# EAGLE design dc-dc-converter (EAGLE 9.0.0)
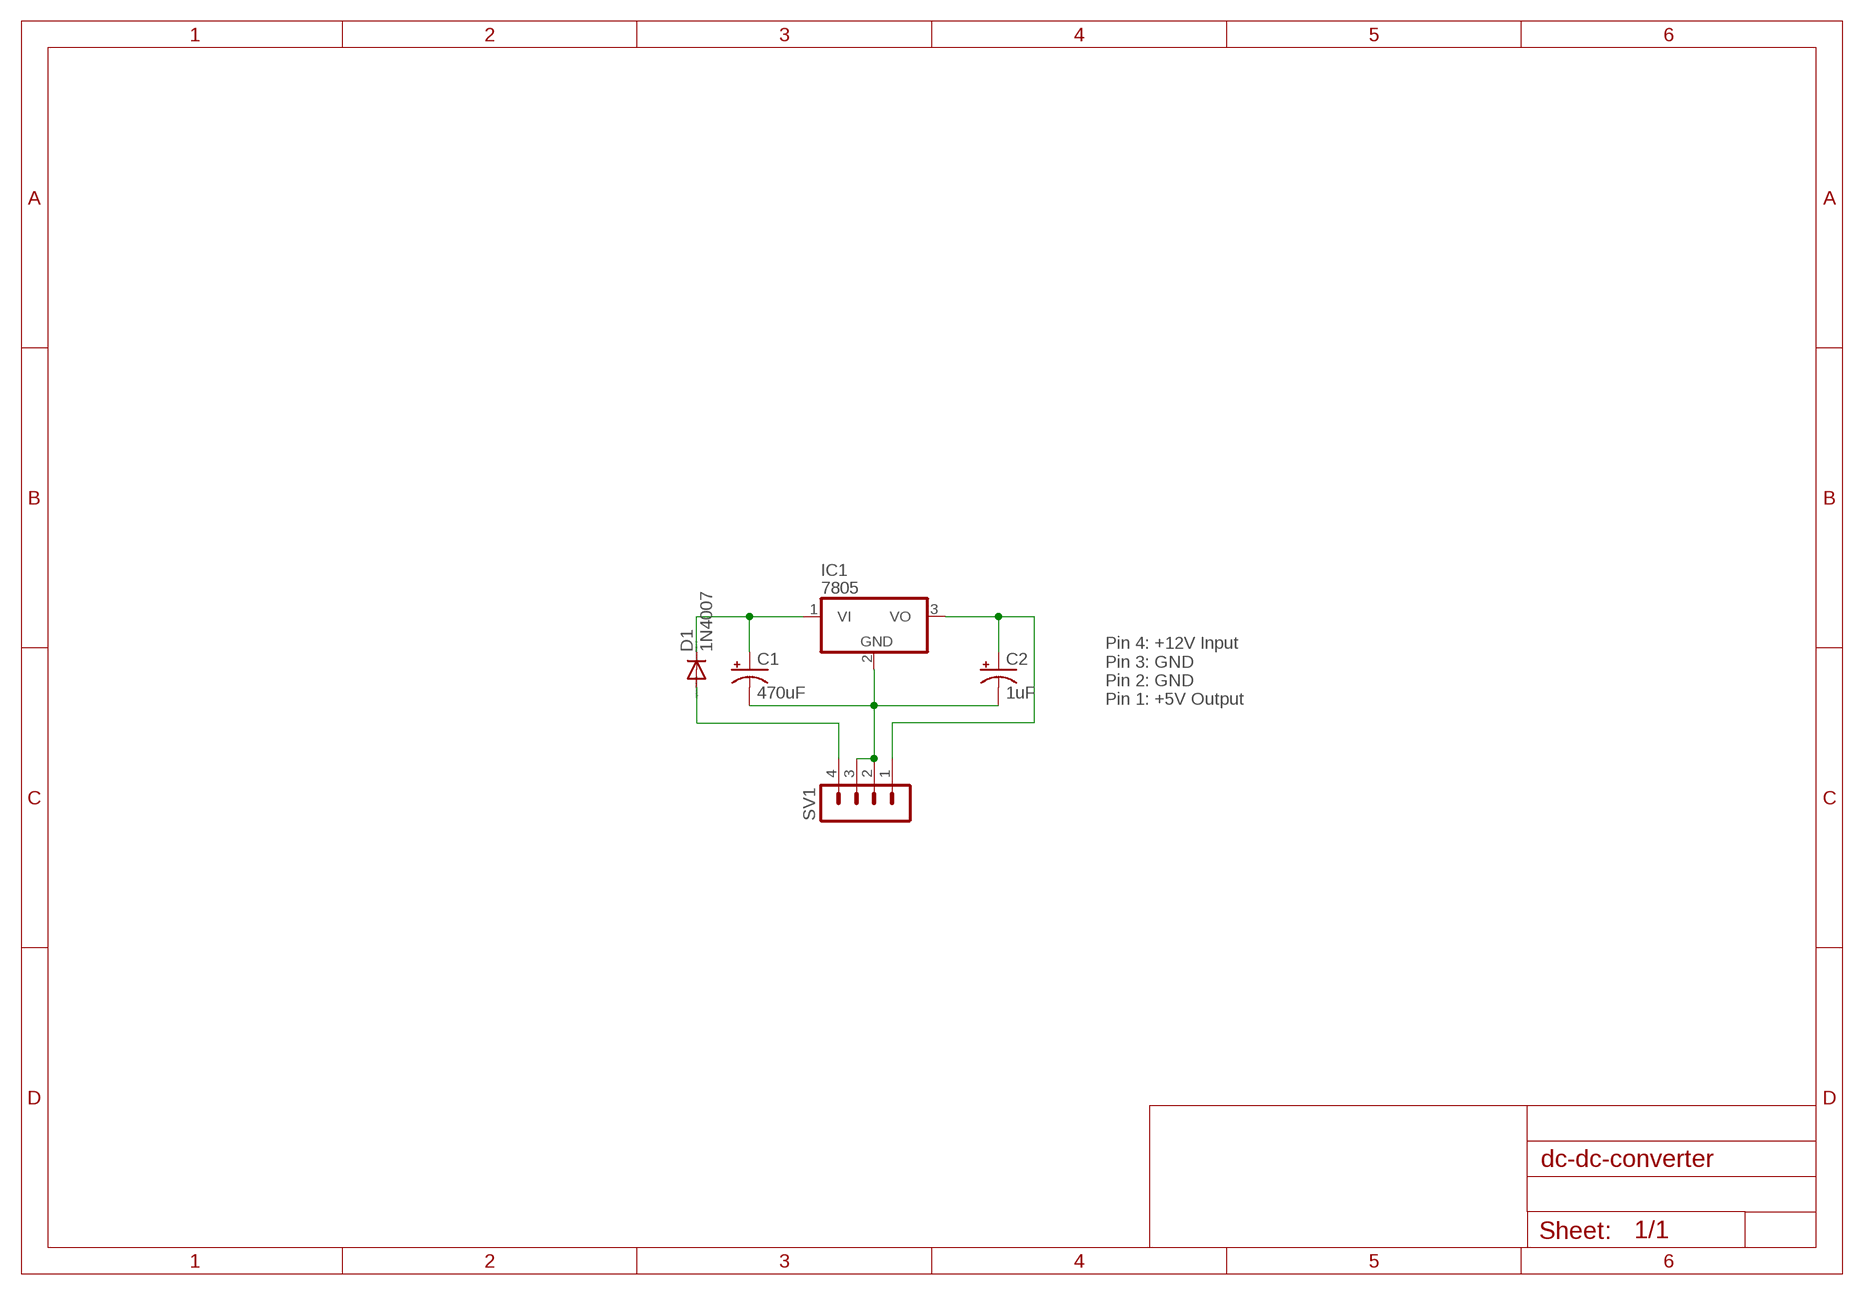
[diagram p0: schematic, sheet 1]

## Parts
C1  470uF  CPOL-USB45181A  [B45181A]
C2  1uF  CPOL-USB45181A  [B45181A]
D1  1N4007  1N4004  [DO41-10]
IC1  7805  7805TV  [TO220V]
SV1  MA04-1  [MA04-1]

## Nets
N$1: C1.+ D1.C IC1.1(VI)
N$2: D1.A SV1.4
N$3: C2.+ IC1.3(VO) SV1.1
N$4: C1.- C2.- IC1.2(GND) SV1.2 SV1.3

## Notes on the sheet
- Pin 4: +12V Input
  Pin 3: GND
  Pin 2: GND
  Pin 1: +5V Output

## Library data of the parts
C1 C2 = rcl:CPOL-US: POLARIZED CAPACITOR, American symbol; SPICEPREFIX: C
D1 = diode:1N4004: DIODE general purpose rectifier, 1 A
IC1 = linear:78*: Positive VOLTAGE REGULATOR Source: http://cache.national.com/ds/LM/LM78L05.pdf http://www.fairchildsemi.com/ds/LM/LM7805.pdf
SV1 = con-lstb:MA04-1: PIN HEADER; OC_FARNELL: unknown; OC_NEWARK: unknown

## Board
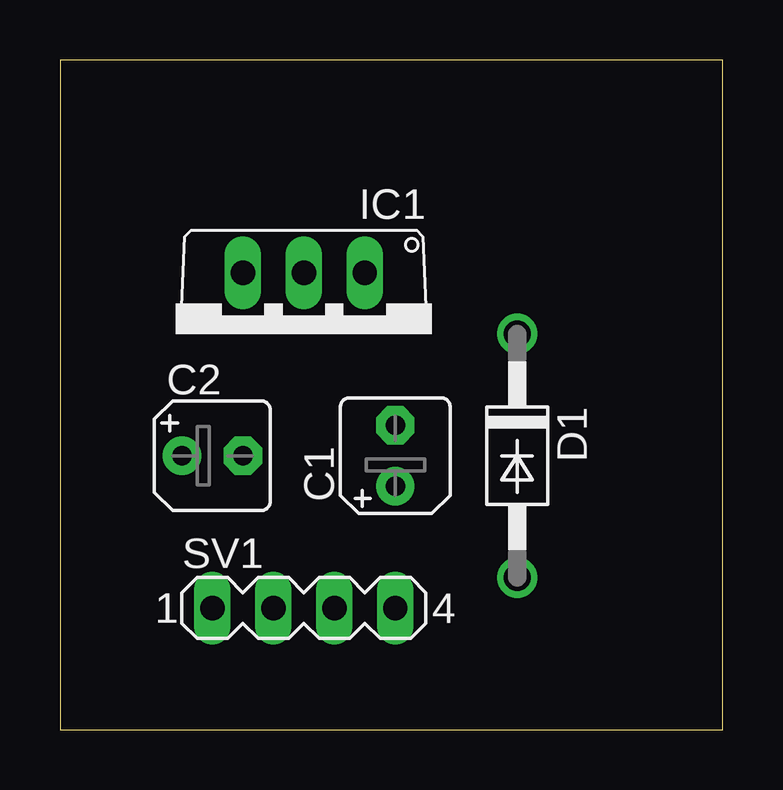
[diagram p1: board, top side]
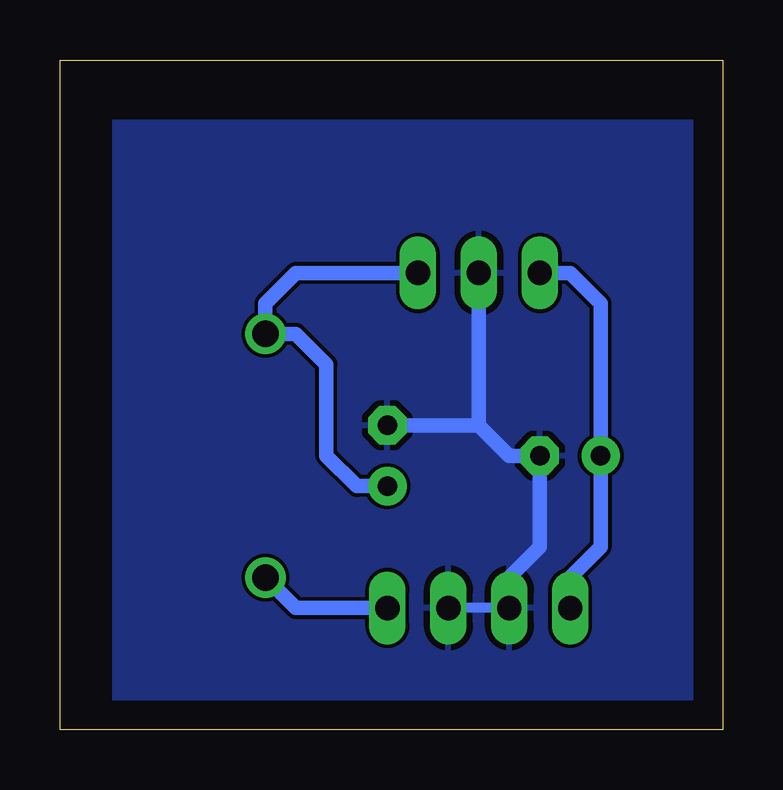
[diagram p2: board, bottom side, seen from below]

Size 27.61 x 27.93 mm. Coordinates in mm from the lower left corner, seen from the top.
Outline: 0,0 27.61,0 27.61,27.93 0,27.93 0,0
Copper layers (1*16): Top 0.035mm / dielectric 1.5mm / Bottom 0.035mm
Design rules "default": minimum track width 6mil, minimum drill 0.35mm, track to track 6mil, track to pad 6mil, pad to pad 6mil, via to via 6mil, smd to smd 6mil, copper to edge 40mil, drill to drill 6mil, minimum pad ring 10mil, minimum via ring 8mil, stop-mask expansion 4mil, vias tented up to drill 0mil, thermal gap 10mil

### Footprints (pad centres in the part's own frame; a part is rotated, then mirrored left to right if it is on the bottom)
B45181A = drill 0.813 pad 1.6: + -1.27,0 | drill 0.813 pad 1.6 octagon: - 1.27,0
DO41-10 = drill 1.118: A 5.08,0; C -5.08,0
TO220V = drill 1.016 long: 1 -2.54,-2.54; 2 0,-2.54; 3 2.54,-2.54
MA04-1 = drill 1.016 long: 1 -3.81,0; 2 -1.27,0; 3 1.27,0; 4 3.81,0

### Placement (x,y rotation side)
C1  13.97,11.43 90 top
C2  6.35,11.43 0 top
D1  19.05,11.43 270 top
IC1  10.16,16.51 180 top
SV1  10.16,5.08 0 top

### Tracks (layer width: path | path; a pad name or v marks a point on that pad's centre or on a via)
N$1
  Bottom 0.61: IC1.1 17.78,19.05 19.05,17.78 D1.C 17.78,16.51 16.51,15.24 16.51,11.43 15.24,10.16 C1.+
N$2
  Bottom 0.61: D1.A 17.78,5.08 SV1.4
N$3
  Bottom 0.61: IC1.3 6.35,19.05 5.08,17.78 C2.+ 5.08,7.62 6.35,6.35 SV1.1
N$4
  Bottom 0.406: SV1.2 SV1.3
  Bottom 0.61: 10.16,12.7 8.89,11.43 C2.- 7.62,7.62 8.89,6.35 SV1.2 | 10.16,12.7 IC1.2 | 10.16,12.7 C1.-
  pour Bottom: 1.27,25.4 25.4,25.4 25.4,1.27 1.27,1.27